# Altium project nha-sau.PrjPcb
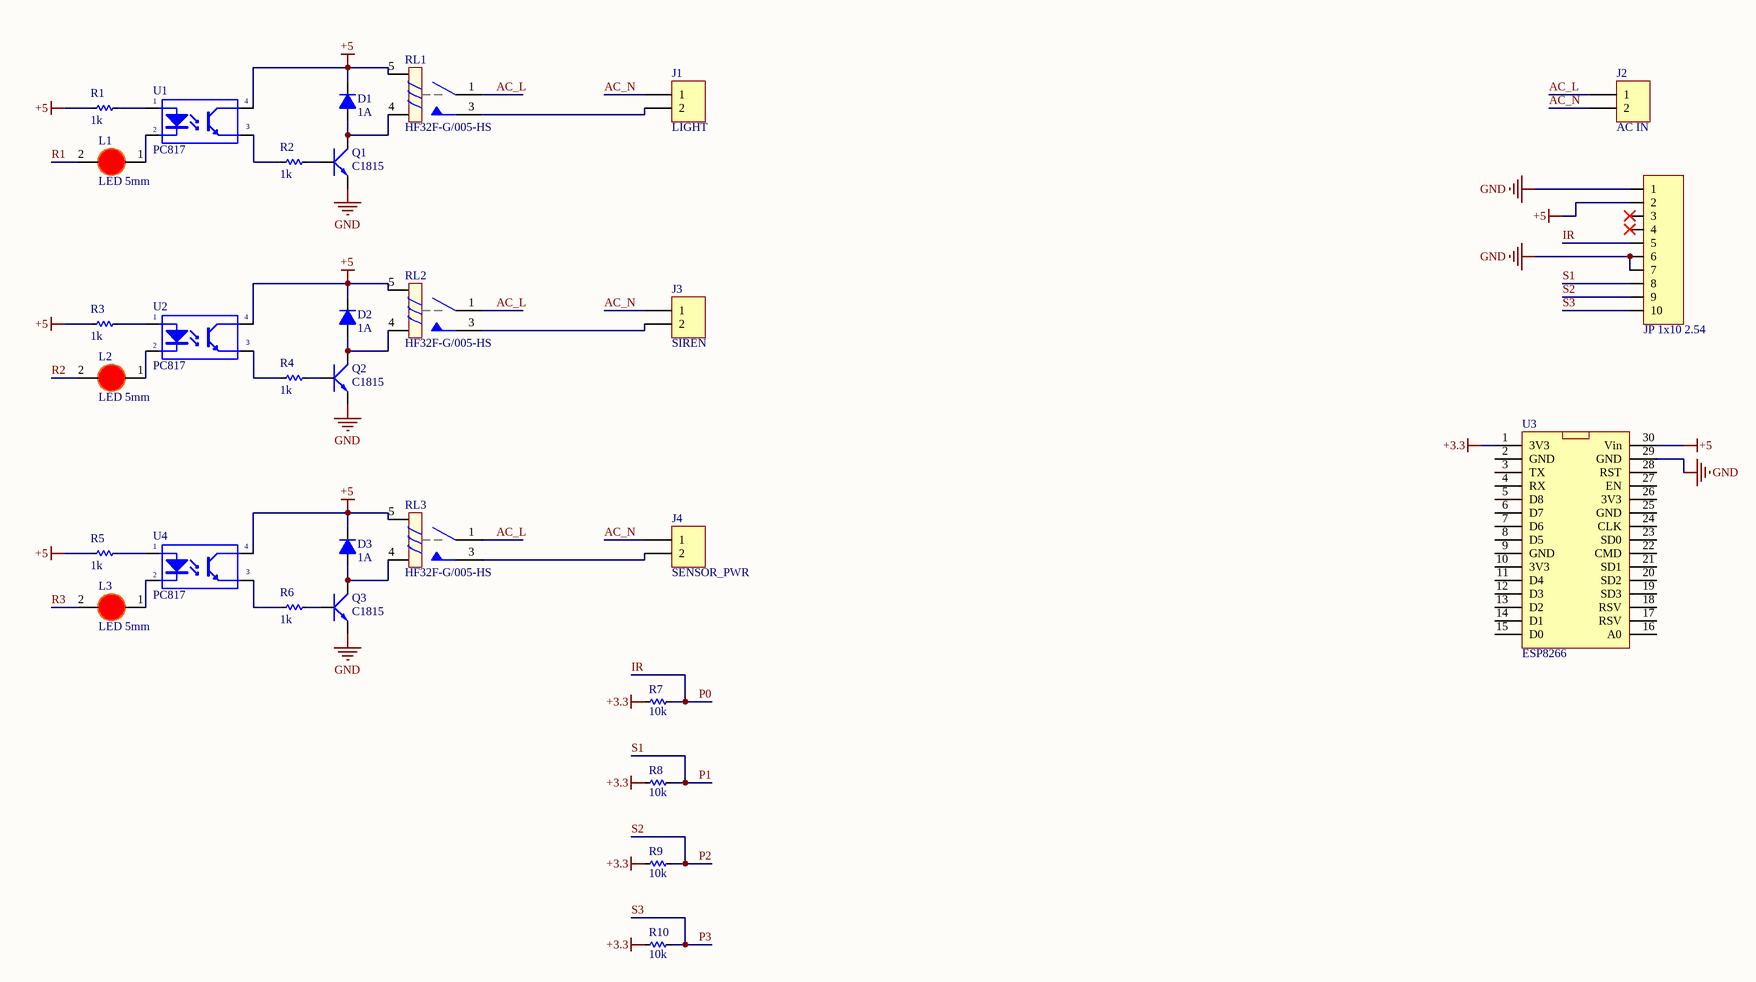
[diagram p0: Sheet1.SchDoc]
1 sheet, 31 parts. Net scope: global (net labels, ports and power ports of the same name join across sheets).
Board file: PCB1.PcbDoc

## Sheet Sheet1.SchDoc
size A3; SheetNumber: 1; SheetTotal: 1

### Parts
D1  1A  [DIODE 1A]
D2  1A  [DIODE 1A]
D3  1A  [DIODE 1A]
J1  LIGHT  [CON 2 2EDG5.08 B]
J2  AC IN  [CON 2 2EDG5.08 B]
J3  SIREN  [CON 2 2EDG5.08 B]
J4  SENSOR_PWR  [CON 2 2EDG5.08 B]
JP1  JP 1x10 2.54  [JP 1x10 CT]
L1  LED 5mm  [LED-5MM-RED]
L2  LED 5mm  [LED-5MM-RED]
L3  LED 5mm  [LED-5MM-RED]
Q1  C1815  [TO92]
Q2  C1815  [TO92]
Q3  C1815  [TO92]
R1  1k  [RES-1/4W]
R2  1k  [RES-1/4W]
R3  1k  [RES-1/4W]
R4  1k  [RES-1/4W]
R5  1k  [RES-1/4W]
R6  1k  [RES-1/4W]
R7  10k  [RES-1/4W]
R8  10k  [RES-1/4W]
R9  10k  [RES-1/4W]
R10  10k  [RES-1/4W]
RL1  HF32F-G/005-HS  [HF32F-G]
RL2  HF32F-G/005-HS  [HF32F-G]
RL3  HF32F-G/005-HS  [HF32F-G]
U1  PC817  [DIP4]
U2  PC817  [DIP4]
U3  ESP8266  [NODE MCU CH340]
U4  PC817  [DIP4]

### Nets
+3.3: R7.2 R8.2 R9.2 R10.2 U3.1(3V3)
+5: D1.2(K) D2.2(K) D3.2(K) JP1.2 R1.1 R3.1 R5.1 RL1.5 RL2.5 RL3.5 U1.4(C) U2.4(C) U3.30(Vin) U4.4(C)
GND: JP1.1 JP1.6 JP1.7 Q1.1(E) Q2.1(E) Q3.1(E) U3.29(GND)
AC_L: J2.1 RL1.1 RL2.1 RL3.1
AC_N: J1.1 J2.2 J3.1 J4.1
IR: JP1.5 R7.1  [also labelled P0]
P1: JP1.8 R8.1  [also labelled S1]
P2: JP1.9 R9.1  [also labelled S2]
P3: JP1.10 R10.1  [also labelled S3]
R1: L1.2(K)
R2: L2.2(K)
R3: L3.2(K)
NetD1_1: D1.1(A) Q1.2(C) RL1.4
NetD2_1: D2.1(A) Q2.2(C) RL2.4
NetD3_1: D3.1(A) Q3.2(C) RL3.4
NetJ1_2: J1.2 RL1.3
NetJ3_2: J3.2 RL2.3
NetJ4_2: J4.2 RL3.3
NetL1_1: L1.1(A) U1.2(K)
NetL2_1: L2.1(A) U2.2(K)
NetL3_1: L3.1(A) U4.2(K)
NetQ1_3: Q1.3(B) R2.2
NetQ2_3: Q2.3(B) R4.2
NetQ3_3: Q3.3(B) R6.2
NetR1_2: R1.2 U1.1(A)
NetR2_1: R2.1 U1.3(E)
NetR3_2: R3.2 U2.1(A)
NetR4_1: R4.1 U2.3(E)
NetR5_2: R5.2 U4.1(A)
NetR6_1: R6.1 U4.3(E)

Not connected (* = marked no-connect by the designer): JP1 3* 4*; U3 2(GND) 3(TX) 4(RX) 5(D8) 6(D7) 7(D6) 8(D5) 9(GND) 10(3V3) 11(D4) 12(D3) 13(D2) 14(D1) 15(D0) 16(A0) 17(RSV) 18(RSV) 19(SD3) 20(SD2) 21(SD1) 22(CMD) 23(SD0) 24(CLK) 25(GND) 26(3V3) 27(EN) 28(RST)

### Library data of the parts
D1-D3 = Diode 1N4007: Cắm; Ten_Linh_Kien: Diode 1N4007 1A (DIP); Don_Vi: Con; Ma_Hang: MH001063; Ghi Chu: *; Kieu_Chan: *; Chung_Loai: Cắm
J1-J4 = CON 2 EDG5.08: CON2 KF terminal
JP1 = JP 1x10 2.54 Cai Thang: Cắm; Ten_Linh_Kien: Jump Đơn Cái 2.54MM 1x20P Thẳng; Don_Vi: Con; Ma_Hang: MH004006; Ghi_Chu: *; Kieu_Chan: *; Chung_Loai: Cắm
L1-L3 = LED 5mm Do: Cắm; Don_Vi: Con; Ma_Hang: MH008967; Ten_Linh_Kien: Led 5MM Phủ Đỏ (1000c); Ghi_Chu: *; Kieu_Chan: *; Chung_Loai: Cắm
Q1-Q3 = Trans C1815 DIP: NPN transistor; Value: C9014
R1-R10 = Res: Manufacturer: Generic Components; Class: Passive; SubClass: R; Published: 08/06/2000; Publisher: Altium Hobart Technology Centre
RL1-RL3 = Relay HF 10A: Relay hongfa 10A 4P HF32F-G/005-HS
U1 U2 U4 = PC817: Single Opto; Value: PC817
U3 = NODEMCU 1.0: ESP8266 nodemcu 1.0